# Altium project TX_Board.PrjPcb (part 3 of 5)
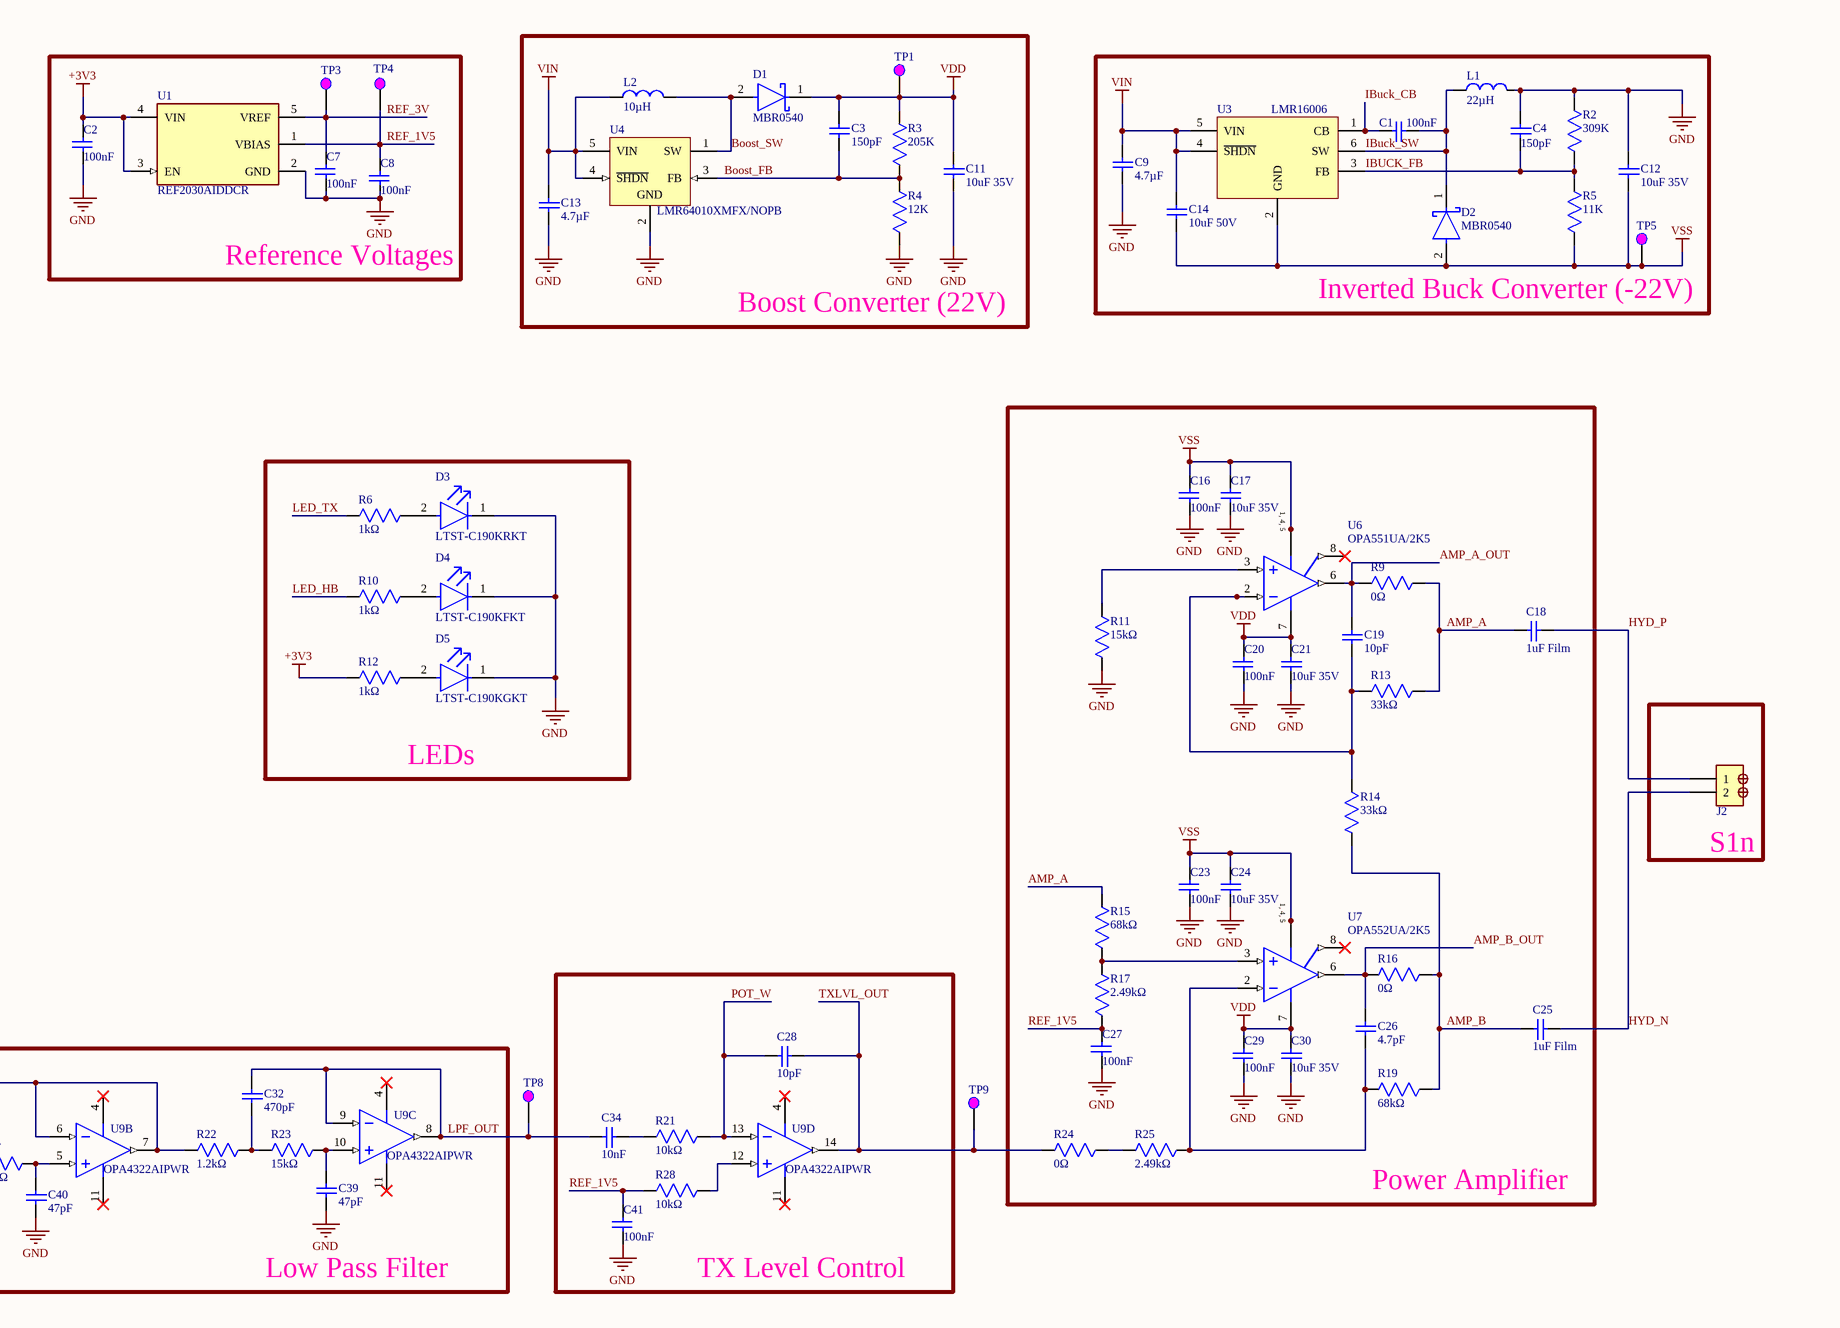
[diagram p3: TX_Board.SchDoc, right]

## Sheet TX_Board.SchDoc (continued)

### Library data of the parts (continued)
C32 C33 = CC0603FRNPO9BN471: 50V 470pF NP0 ±1% 0603 Multilayer Ceramic Capacitors MLCC - SMD/SMT ROHS; Manufacturer: Yageo Group; Dielectric: C0G; Dissipation Factor: 0.1%; Insulation Resistance: 10GΩ; Supplier: Newark; Supplier Part Number: CC0603FRNPO9BN471; Manufacturer Part Number: CC0603FRNPO9BN471; RoHS: Compliant; Category: Ceramic Capacitors; Stock: 7080; Pricing: 1=0.0986, 11=0.0703, 101=0.0582, 501=0.0554, 1001=0.0547 (USD); Value: 470pF; Case/Package: 0603; Case Code (Imperial): 0603; Case Code (Metric): 1608; China RoHS: Compliant; Composition: Ceramic; Depth: 800µm; Dielectric Material: Ceramic; Halogen Free: Halogen Free; Height: 800µm; Lead Free: Lead Free; Length: 1.6mm; Lifecycle Status: Production; Max Operating Temperature: 125°C; Min Operating Temperature: -55°C; Mounting Technology: Surface Mount; Number of Terminals: 2; Packaging: Tape and Reel; Radiation Hardening: No; REACH SVHC: Unaffected; Schedule B: 8532240020, 8532240020|8532240020, 8532240020|8532240020|8532240020, 8532240020|8532240020|8532240020|8532240020; Termination: SMD/SMT; Thickness: 889µm; Tolerance: 1%; Voltage Rating: 50V; Voltage Rating (DC): 50V; Width: 800µm; ComponentLink1URL: https://datasheet.octopart.com:443/CC0603FRNPO9BN471-Yageo-datasheet-182140217.pdf?src-supplier=IHS; ComponentLink1Description: https://datasheet.octopart.com:443/CC0603FRNPO9BN471-Yageo-datasheet-182140217.pdf?src-supplier=IHS; ComponentLink2URL: https://datasheet.octopart.com:443/CC0603FRNPO9BN471-Yageo-datasheet-151948684.pdf?src-supplier=HQonline; ComponentLink2Description: https://datasheet.octopart.com:443/CC0603FRNPO9BN471-Yageo-datasheet-151948684.pdf?src-supplier=HQonline; ComponentLink3URL: https://datasheet.octopart.com:443/CC0603FRNPO9BN471-Yageo-datasheet-182029577.pdf?src-supplier=Newark; ComponentLink3Description: https://datasheet.octopart.com:443/CC0603FRNPO9BN471-Yageo-datasheet-182029577.pdf?src-supplier=Newark; ComponentLink4URL: https://datasheet.octopart.com:443/CC0603FRNPO9BN471-Yageo-datasheet-182029576.pdf?src-supplier=Newark; ComponentLink4Description: https://datasheet.octopart.com:443/CC0603FRNPO9BN471-Yageo-datasheet-182029576.pdf?src-supplier=Newark; ComponentLink5URL: https://datasheet.octopart.com:443/CC0603FRNPO9BN471-Yageo-Group-datasheet-188129580.pdf?src-supplier=LCSC; ComponentLink5Description: https://datasheet.octopart.com:443/CC0603FRNPO9BN471-Yageo-Group-datasheet-188129580.pdf?src-supplier=LCSC; ComponentLink6URL: https://datasheet.octopart.com:443/CC0603FRNPO9BN471-Yageo-datasheet-137875056.pdf?src-supplier=Future+Electronics; ComponentLink6Description: https://datasheet.octopart.com:443/CC0603FRNPO9BN471-Yageo-datasheet-137875056.pdf?src-supplier=Future+Electronics; ComponentLink7URL: https://datasheet.octopart.com:443/CC0603FRNPO9BN471-Yageo-datasheet-136957424.pdf?src-supplier=Future+Electronics; ComponentLink7Description: https://datasheet.octopart.com:443/CC0603FRNPO9BN471-Yageo-datasheet-136957424.pdf?src-supplier=Future+Electronics; ComponentLink8URL: https://datasheet.octopart.com:443/CC0603FRNPO9BN471-Yageo-datasheet-137700082.pdf?src-supplier=Future+Electronics; ComponentLink8Description: https://datasheet.octopart.com:443/CC0603FRNPO9BN471-Yageo-datasheet-137700082.pdf?src-supplier=Future+Electronics; ComponentLink9URL: https://datasheet.octopart.com:443/CC0603FRNPO9BN471-Yageo-datasheet-78855684.pdf?src-supplier=Future+Electronics; ComponentLink9Description: https://datasheet.octopart.com:443/CC0603FRNPO9BN471-Yageo-datasheet-78855684.pdf?src-supplier=Future+Electronics; ComponentLink10URL: https://datasheet.octopart.com:443/CC0603FRNPO9BN471-Yageo-datasheet-16730043.pdf?src-supplier=Future+Electronics; ComponentLink10Description: https://datasheet.octopart.com:443/CC0603FRNPO9BN471-Yageo-datasheet-16730043.pdf?src-supplier=Future+Electronics; ComponentLink11URL: https://datasheet.octopart.com:443/CC0603FRNPO9BN471-Yageo-datasheet-15895757.pdf?src-supplier=Future+Electronics; ComponentLink11Description: https://datasheet.octopart.com:443/CC0603FRNPO9BN471-Yageo-datasheet-15895757.pdf?src-supplier=Future+Electronics; ComponentLink12URL: https://datasheet.octopart.com:443/CC0603FRNPO9BN471-Yageo-datasheet-12589826.pdf?src-supplier=Future+Electronics; ComponentLink12Description: https://datasheet.octopart.com:443/CC0603FRNPO9BN471-Yageo-datasheet-12589826.pdf?src-supplier=Future+Electronics; ComponentLink13URL: https://datasheet.octopart.com:443/CC0603FRNPO9BN471-Yageo-datasheet-10406438.pdf?src-supplier=Future+Electronics; ComponentLink13Description: https://datasheet.octopart.com:443/CC0603FRNPO9BN471-Yageo-datasheet-10406438.pdf?src-supplier=Future+Electronics; ComponentLink14URL: http://sigma.octopart.com:80/conflict_mineral_statement/Yageo-company-3.pdf?src-supplier=Compliance+Statements; ComponentLink14Description: http://sigma.octopart.com:80/conflict_mineral_statement/Yageo-company-3.pdf?src-supplier=Compliance+Statements; ComponentLink15URL: http://sigma.octopart.com:80/rohs_statement/Yageo-company-2.pdf?src-supplier=Compliance+Statements; ComponentLink15Description: http://sigma.octopart.com:80/rohs_statement/Yageo-company-2.pdf?src-supplier=Compliance+Statements; JLCPCB Part Number: C519564
C34 = CC0603JRX7R9BB103: Surface Mount Ceramic Multilayer Capacitor 0.01uF 5% X7R 50V 0603 Paper T/R; Manufacturer: Yageo Group; Supplier: Newark; Supplier Part Number: CC0603JRX7R9BB103; Manufacturer Part Number: CC0603JRX7R9BB103; RoHS: Compliant; Category: Ceramic Capacitors; Stock: 32119; Pricing: 10=0.03, 20=0.029, 30=0.028, 50=0.027, 100=0.026, 250=0.023, 500=0.019, 1000=0.017 (USD); Value: 10nF; Case/Package: 0603; Case Code (Imperial): 0603; Case Code (Metric): 1608; China RoHS: Compliant; Composition: Ceramic; Depth: 800µm; Dielectric: X7R; Dielectric Material: Ceramic; Halogen Free: Halogen Free; Height: 800µm; Lead Free: Lead Free; Length: 1.6mm; Lifecycle Status: Production; Max Operating Temperature: 125°C; Min Operating Temperature: -55°C; Mounting Technology: Surface Mount; Pins: 2; Number of Terminals: 2; Radiation Hardening: No; REACH SVHC: Unaffected; Schedule B: 8532240020, 8532240020|8532240020, 8532240020|8532240020|8532240020, 8532240020|8532240020|8532240020|8532240020; Termination: SMD/SMT; Thickness: 889µm; Tolerance: 5%; Voltage Rating: 50V; Voltage Rating (DC): 50V; Width: 800µm; ComponentLink1URL: https://datasheet.octopart.com:443/CC0603JRX7R9BB103-Yageo-datasheet-177165144.pdf?src-supplier=IHS; ComponentLink1Description: https://datasheet.octopart.com:443/CC0603JRX7R9BB103-Yageo-datasheet-177165144.pdf?src-supplier=IHS; ComponentLink2URL: https://datasheet.octopart.com/CC0603JRX7R9BB103-Yageo-datasheet-10883670.pdf; ComponentLink2Description: https://datasheet.octopart.com/CC0603JRX7R9BB103-Yageo-datasheet-10883670.pdf; ComponentLink3URL: https://datasheet.octopart.com:443/CC0603JRX7R9BB103-Yageo-datasheet-147453679.pdf?src-supplier=Newark; ComponentLink3Description: https://datasheet.octopart.com:443/CC0603JRX7R9BB103-Yageo-datasheet-147453679.pdf?src-supplier=Newark; ComponentLink4URL: https://datasheet.octopart.com:443/CC0603JRX7R9BB103-Yageo-datasheet-140260305.pdf?src-supplier=Farnell; ComponentLink4Description: https://datasheet.octopart.com:443/CC0603JRX7R9BB103-Yageo-datasheet-140260305.pdf?src-supplier=Farnell; ComponentLink5URL: https://datasheet.octopart.com:443/CC0603JRX7R9BB103-Yageo-datasheet-181968368.pdf?src-supplier=Farnell; ComponentLink5Description: https://datasheet.octopart.com:443/CC0603JRX7R9BB103-Yageo-datasheet-181968368.pdf?src-supplier=Farnell; ComponentLink6URL: https://datasheet.octopart.com:443/CC0603JRX7R9BB103-Yageo-datasheet-62336348.pdf?src-supplier=element14+APAC; ComponentLink6Description: https://datasheet.octopart.com:443/CC0603JRX7R9BB103-Yageo-datasheet-62336348.pdf?src-supplier=element14+APAC; ComponentLink7URL: https://datasheet.octopart.com:443/CC0603JRX7R9BB103-Yageo-datasheet-499490.pdf?src-supplier=element14; ComponentLink7Description: https://datasheet.octopart.com:443/CC0603JRX7R9BB103-Yageo-datasheet-499490.pdf?src-supplier=element14; ComponentLink8URL: https://datasheet.octopart.com:443/CC0603JRX7R9BB103-Yageo-datasheet-8701427.pdf?src-supplier=element14; ComponentLink8Description: https://datasheet.octopart.com:443/CC0603JRX7R9BB103-Yageo-datasheet-8701427.pdf?src-supplier=element14; ComponentLink9URL: https://datasheet.octopart.com:443/CC0603JRX7R9BB103-Yageo-datasheet-5301394.pdf?src-supplier=element14; ComponentLink9Description: https://datasheet.octopart.com:443/CC0603JRX7R9BB103-Yageo-datasheet-5301394.pdf?src-supplier=element14; ComponentLink10URL: https://datasheet.octopart.com:443/CC0603JRX7R9BB103-Yageo-datasheet-166511530.pdf?src-supplier=Future+Electronics; ComponentLink10Description: https://datasheet.octopart.com:443/CC0603JRX7R9BB103-Yageo-datasheet-166511530.pdf?src-supplier=Future+Electronics; ComponentLink11URL: https://datasheet.octopart.com:443/CC0603JRX7R9BB103-Yageo-datasheet-137700082.pdf?src-supplier=Future+Electronics; ComponentLink11Description: https://datasheet.octopart.com:443/CC0603JRX7R9BB103-Yageo-datasheet-137700082.pdf?src-supplier=Future+Electronics; ComponentLink12URL: https://datasheet.octopart.com:443/CC0603JRX7R9BB103-Yageo-datasheet-137700084.pdf?src-supplier=Future+Electronics; ComponentLink12Description: https://datasheet.octopart.com:443/CC0603JRX7R9BB103-Yageo-datasheet-137700084.pdf?src-supplier=Future+Electronics; ComponentLink13URL: https://datasheet.octopart.com:443/CC0603JRX7R9BB103-Yageo-datasheet-27626582.pdf?src-supplier=Future+Electronics; ComponentLink13Description: https://datasheet.octopart.com:443/CC0603JRX7R9BB103-Yageo-datasheet-27626582.pdf?src-supplier=Future+Electronics; ComponentLink14URL: https://datasheet.octopart.com:443/CC0603JRX7R9BB103-Yageo-datasheet-15895757.pdf?src-supplier=Future+Electronics; ComponentLink14Description: https://datasheet.octopart.com:443/CC0603JRX7R9BB103-Yageo-datasheet-15895757.pdf?src-supplier=Future+Electronics; ComponentLink15URL: https://datasheet.octopart.com:443/CC0603JRX7R9BB103-Yageo-datasheet-12526321.pdf?src-supplier=Future+Electronics; ComponentLink15Description: https://datasheet.octopart.com:443/CC0603JRX7R9BB103-Yageo-datasheet-12526321.pdf?src-supplier=Future+Electronics; ComponentLink16URL: https://datasheet.octopart.com:443/CC0603JRX7R9BB103-Yageo-Group-datasheet-165992755.pdf?src-supplier=ODG+(Origin+Data+Global); ComponentLink16Description: https://datasheet.octopart.com:443/CC0603JRX7R9BB103-Yageo-Group-datasheet-165992755.pdf?src-supplier=ODG+(Origin+Data+Global); ComponentLink17URL: https://datasheet.octopart.com:443/CC0603JRX7R9BB103-Yageo-datasheet-151948686.pdf?src-supplier=TME; ComponentLink17Description: https://datasheet.octopart.com:443/CC0603JRX7R9BB103-Yageo-datasheet-151948686.pdf?src-supplier=TME; ComponentLink18URL: http://sigma.octopart.com:80/conflict_mineral_statement/Yageo-company-3.pdf?src-supplier=Compliance+Statements; ComponentLink18Description: http://sigma.octopart.com:80/conflict_mineral_statement/Yageo-company-3.pdf?src-supplier=Compliance+Statements; ComponentLink19URL: http://sigma.octopart.com:80/rohs_statement/Yageo-company-2.pdf?src-supplier=Compliance+Statements; ComponentLink19Description: http://sigma.octopart.com:80/rohs_statement/Yageo-company-2.pdf?src-supplier=Compliance+Statements; JLCPCB Part Number: C115056
C39 C40 C42 = CC0603FRNPO9BN470: Surface Mount Ceramic Multilayer Capacitor 47pF 1% C0G 50V 0603 Paper T/R; Manufacturer: Yageo Group; Temperature Coefficient: 30ppm/°C; Supplier: Newark; Supplier Part Number: CC0603FRNPO9BN470; Manufacturer Part Number: CC0603FRNPO9BN470; RoHS: Compliant; Category: Ceramic Capacitors; Stock: 37203; Pricing: 1=0.164, 25=0.068, 100=0.06, 250=0.053, 500=0.046, 1000=0.042, 2500=0.036, 5000=0.03 (USD); Value: 47pF; Case/Package: 0603; Case Code (Imperial): 0603; Case Code (Metric): 1608; China RoHS: Compliant; Composition: Ceramic; Depth: 800µm; Dielectric: C0G; Dielectric Material: Ceramic; Halogen Free: Halogen Free; Height: 800µm; Lead Free: Lead Free; Length: 1.6mm; Lifecycle Status: Production; Max Operating Temperature: 125°C; Min Operating Temperature: -55°C; Mounting Technology: Surface Mount; Pins: 2; Number of Terminals: 2; Radiation Hardening: No; REACH SVHC: Unaffected; Schedule B: 8532240020, 8532240020|8532240020, 8532240020|8532240020|8532240020, 8532240020|8532240020|8532240020|8532240020; Termination: SMD/SMT; Thickness: 889µm; Tolerance: 1%; Voltage: 50V; Voltage Rating: 50V; Voltage Rating (DC): 50V; Width: 800µm; ComponentLink1URL: https://datasheet.octopart.com:443/CC0603FRNPO9BN470-Yageo-datasheet-182140217.pdf?src-supplier=IHS; ComponentLink1Description: https://datasheet.octopart.com:443/CC0603FRNPO9BN470-Yageo-datasheet-182140217.pdf?src-supplier=IHS; ComponentLink2URL: https://datasheet.octopart.com:443/CC0603FRNPO9BN470-Yageo-datasheet-151948684.pdf?src-supplier=element14+APAC; ComponentLink2Description: https://datasheet.octopart.com:443/CC0603FRNPO9BN470-Yageo-datasheet-151948684.pdf?src-supplier=element14+APAC; ComponentLink3URL: https://datasheet.octopart.com:443/CC0603FRNPO9BN470-Yageo-datasheet-65873193.pdf?src-supplier=element14+APAC; ComponentLink3Description: https://datasheet.octopart.com:443/CC0603FRNPO9BN470-Yageo-datasheet-65873193.pdf?src-supplier=element14+APAC; ComponentLink4URL: https://datasheet.octopart.com:443/CC0603FRNPO9BN470-Yageo-datasheet-182029575.pdf?src-supplier=Farnell; ComponentLink4Description: https://datasheet.octopart.com:443/CC0603FRNPO9BN470-Yageo-datasheet-182029575.pdf?src-supplier=Farnell; ComponentLink5URL: https://datasheet.octopart.com:443/CC0603FRNPO9BN470-Yageo-datasheet-182029574.pdf?src-supplier=Farnell; ComponentLink5Description: https://datasheet.octopart.com:443/CC0603FRNPO9BN470-Yageo-datasheet-182029574.pdf?src-supplier=Farnell; ComponentLink6URL: https://datasheet.octopart.com:443/CC0603FRNPO9BN470-Yageo-datasheet-10406438.pdf?src-supplier=Newark; ComponentLink6Description: https://datasheet.octopart.com:443/CC0603FRNPO9BN470-Yageo-datasheet-10406438.pdf?src-supplier=Newark; ComponentLink7URL: https://datasheet.octopart.com:443/CC0603FRNPO9BN470-Yageo-Group-datasheet-189192896.pdf?src-supplier=TME; ComponentLink7Description: https://datasheet.octopart.com:443/CC0603FRNPO9BN470-Yageo-Group-datasheet-189192896.pdf?src-supplier=TME; ComponentLink8URL: https://datasheet.octopart.com:443/CC0603FRNPO9BN470-Yageo-Group-datasheet-188129580.pdf?src-supplier=LCSC; ComponentLink8Description: https://datasheet.octopart.com:443/CC0603FRNPO9BN470-Yageo-Group-datasheet-188129580.pdf?src-supplier=LCSC; ComponentLink9URL: https://datasheet.octopart.com:443/CC0603FRNPO9BN470-Yageo-datasheet-137875056.pdf?src-supplier=Future+Electronics; ComponentLink9Description: https://datasheet.octopart.com:443/CC0603FRNPO9BN470-Yageo-datasheet-137875056.pdf?src-supplier=Future+Electronics; ComponentLink10URL: https://datasheet.octopart.com:443/CC0603FRNPO9BN470-Yageo-datasheet-136957424.pdf?src-supplier=Future+Electronics; ComponentLink10Description: https://datasheet.octopart.com:443/CC0603FRNPO9BN470-Yageo-datasheet-136957424.pdf?src-supplier=Future+Electronics; ComponentLink11URL: https://datasheet.octopart.com:443/CC0603FRNPO9BN470-Yageo-datasheet-137700082.pdf?src-supplier=Future+Electronics; ComponentLink11Description: https://datasheet.octopart.com:443/CC0603FRNPO9BN470-Yageo-datasheet-137700082.pdf?src-supplier=Future+Electronics; ComponentLink12URL: https://datasheet.octopart.com:443/CC0603FRNPO9BN470-Yageo-datasheet-78855684.pdf?src-supplier=Future+Electronics; ComponentLink12Description: https://datasheet.octopart.com:443/CC0603FRNPO9BN470-Yageo-datasheet-78855684.pdf?src-supplier=Future+Electronics; ComponentLink13URL: https://datasheet.octopart.com:443/CC0603FRNPO9BN470-Yageo-datasheet-16730043.pdf?src-supplier=Future+Electronics; ComponentLink13Description: https://datasheet.octopart.com:443/CC0603FRNPO9BN470-Yageo-datasheet-16730043.pdf?src-supplier=Future+Electronics; ComponentLink14URL: https://datasheet.octopart.com:443/CC0603FRNPO9BN470-Yageo-datasheet-12589826.pdf?src-supplier=Future+Electronics; ComponentLink14Description: https://datasheet.octopart.com:443/CC0603FRNPO9BN470-Yageo-datasheet-12589826.pdf?src-supplier=Future+Electronics; ComponentLink15URL: https://datasheet.octopart.com:443/CC0603FRNPO9BN470-Yageo-datasheet-8817079.pdf?src-supplier=Future+Electronics; ComponentLink15Description: https://datasheet.octopart.com:443/CC0603FRNPO9BN470-Yageo-datasheet-8817079.pdf?src-supplier=Future+Electronics; ComponentLink16URL: https://datasheet.octopart.com:443/CC0603FRNPO9BN470-Yageo-datasheet-8324240.pdf?src-supplier=Future+Electronics; ComponentLink16Description: https://datasheet.octopart.com:443/CC0603FRNPO9BN470-Yageo-datasheet-8324240.pdf?src-supplier=Future+Electronics; ComponentLink17URL: https://datasheet.octopart.com:443/CC0603FRNPO9BN470-Yageo-datasheet-504625.pdf?src-supplier=Future+Electronics; ComponentLink17Description: https://datasheet.octopart.com:443/CC0603FRNPO9BN470-Yageo-datasheet-504625.pdf?src-supplier=Future+Electronics; ComponentLink18URL: https://datasheet.octopart.com:443/CC0603FRNPO9BN470-Yageo-datasheet-5321569.pdf?src-supplier=Future+Electronics; ComponentLink18Description: https://datasheet.octopart.com:443/CC0603FRNPO9BN470-Yageo-datasheet-5321569.pdf?src-supplier=Future+Electronics; ComponentLink19URL: http://sigma.octopart.com:80/conflict_mineral_statement/Yageo-company-3.pdf?src-supplier=Compliance+Statements; ComponentLink19Description: http://sigma.octopart.com:80/conflict_mineral_statement/Yageo-company-3.pdf?src-supplier=Compliance+Statements; ComponentLink20URL: http://sigma.octopart.com:80/rohs_statement/Yageo-company-2.pdf?src-supplier=Compliance+Statements; ComponentLink20Description: http://sigma.octopart.com:80/rohs_statement/Yageo-company-2.pdf?src-supplier=Compliance+Statements; JLCPCB Part Number: C519486
D1 D2 = CMP-2000-05114-2: DIODE SCHOTTKY 40V 500MA SOD123; Max Surge Current: 5.5A; Max Reverse Leakage Current: 20uA; Forward Voltage: 620mV; Element Configuration: Single; Polarity: Standard; Power Dissipation: 400mW; Current Rating: 500A; Max Operating Temperature: 125°C; REACH SVHC: No SVHC; Voltage Rating (DC): 40V; Mount: Surface Mount; Max Reverse Voltage (DC): 40V; Max Forward Surge Current (Ifsm): 5.5A; Height: 1.03mm; Package Quantity: 3000; Forward Current: 500mA; Average Rectified Current: 500mA; Weight: 0.03g; Output Current: 500mA; Contact Plating: Tin; Packaging: Tape and Reel; Width: 1.6mm; Radiation Hardening: No; Peak Non-Repetitive Surge Current: 5.5A; Max Repetitive Reverse Voltage (Vrrm): 40V; Length: 2.7mm; Lead Free: Lead Free; Min Operating Temperature: -65°C; Number of Pins: 2; Peak Reverse Current: 20uA; JLCPCB Part Number: C21353
D3 = CMP-1674-00011-2: LED RED CLEAR CHIP SMD; Reverse Voltage: 5V; Viewing Angle: 130°; Power Rating: 75mW; Test Current: 20mA; Number of Elements: 1; Lens Color: Colorless; Wavelength: 639nm; Dominant Wavelength: 631nm; Lens Style: Diffused; Forward Current: 30mA; Forward Voltage: 2.4V; Luminous Intensity: 54mcd; Color: Red; Case Code (Imperial): 0603; Lens Transparency: Clear; Lead Free: Lead Free; Package Quantity: 1; Packaging: Tape and Reel; Max Operating Temperature: 85°C; Number of Pins: 2; Height: 0.8mm; Case/Package: 0603; Number of LEDs: 1; Width: 0.8mm; Case Code (Metric): 1608; Depth: 0.8mm; Mount: Surface Mount; Radiation Hardening: No; Length: 1.6mm; Illumination Color: Red; Power Dissipation: 75mW; Min Operating Temperature: -55°C; JLCPCB Part Number: C94869
D4 = CMP-1674-00008-9: LED ORANGE CLEAR CHIP SMD; Luminous Intensity: 90mcd; Viewing Angle: 130°; Wavelength: 611nm; Lens Color: Colorless; Test Current: 20mA; Lens Style: Flat; Reverse Voltage: 5V; Power Dissipation: 75mW; Number of Elements: 1; Forward Current: 30mA; Lens Size: 0.8mm; Dominant Wavelength: 605nm; Forward Voltage: 2V; Min Operating Temperature: -55°C; Lens Transparency: Clear; RoHS Compliant: Yes; Case Code (Metric): 1608; Color: Orange; Width: 0.8mm; Number of Pins: 2; Depth: 1.6mm; Case/Package: 0603; Radiation Hardening: No; Case Code (Imperial): 0603; Max Operating Temperature: 85°C; Number of LEDs: 1; Height: 0.9mm; Mount: Surface Mount; Packaging: Tape and Reel; Length: 3.2mm; Package Quantity: 3000; Power Rating: 75mW; Lead Free: Lead Free; Illumination Color: Orange; Series: -; JLCPCB Part Number: C157740
D5 = CMP-2000-05197-2: LED GREEN CLEAR CHIP SMD; Test Current: 20mA; Power Rating: 75mW; Forward Voltage: 2V; Wavelength: 574nm; Number of LEDs: 1; Reverse Voltage: 5V; Dominant Wavelength: 571nm; Lens Style: Diffused; Luminous Intensity: 35mcd; Forward Current: 30mA; Viewing Angle: 130°; Lens Color: Colorless; Width: 0.8mm; Case Code (Imperial): 0603; Case Code (Metric): 1608; Number of Pins: 2; Radiation Hardening: No; Package Quantity: 1; Lead Free: Lead Free; Lens Transparency: Clear; Depth: 0.8mm; Power Dissipation: 75mW; Mount: Surface Mount; Max Operating Temperature: 85°C; Case/Package: 0603; Height: 0.8mm; Illumination Color: Green; Color: Green; Length: 1.6mm; Packaging: Tape and Reel; Number of Elements: 1; Min Operating Temperature: -55°C; JLCPCB Part Number: C125094
D6 = SS34: -55℃~+125℃ 3A 40V 500uA@40V 550mV@3A Independent SMA(DO-214AC) Schottky Diodes ROHS; Manufacturer: MDD; Manufacturer Part Number: SS34; Category: Schottky Diodes; JLCPCB Part Number: C8678
D7 = SMAJ15A: SMAJ Series 24.4 V 400 W Surface Mount Uni-Directional TVS Diode - DO-214AC; Manufacturer: Littelfuse; Breakdown Voltage: 17.6V; Clamping Voltage: 24.4V; Direction: Unidirectional; Element Configuration: Single; Forward Voltage: 3.5V; Leakage Current: 1µA; Max Breakdown Voltage: 18.5V; Max Junction Temperature (Tj): 150°C; Max Power Dissipation: 3.3W; Max Surge Current: 16.4A; Min Breakdown Voltage: 16.7V; Number of Channels: 1; Operating Supply Voltage: 15V; Peak Pulse Power: 400W; Power Line Protection: No; Test Current: 1mA; Supplier: Future Electronics; Supplier Part Number: SMAJ15A; Manufacturer Part Number: SMAJ15A; RoHS: Compliant; Category: TVS Diodes; Stock: 635000; Pricing: 5000=0.0662, 10000=0.0652, 15000=0.0646, 25000=0.0638, 50000=0.0622 (USD); Composition: Zener; Country of Origin: Mainland China; Export Control Classification Number (ECCN) Code: EAR99; Height: 2.29mm; Harmonized Tariff Schedule (HTS) Code: 8541.10.00.50; Introduction Date: 2003-11-20; Lead Free: Lead Free; Length: 4.5mm; Lifecycle Status: Production; Max Operating Temperature: 150°C; Max Reverse Leakage Current: 1µA; Min Operating Temperature: -65°C; Mounting Technology: Surface Mount; Number of Elements: 1; Pins: 2; Number of Terminals: 2; Number of Unidirectional Channels: 1; Packaging: Tape & Reel; Peak Pulse Current: 16.4A; Peak Reverse Current: 1µA; Polarity: Unidirectional; Power Dissipation: 400W; Power Rating: 400W; Radiation Hardening: No; REACH SVHC: Affected; Reverse Breakdown Voltage: 16.7V; Reverse Standoff Voltage: 15V; Reverse Voltage: 15V; Schedule B: 8541100080, 8541100080|8541100080|8541100080|8541100080|8541100080; Termination: SMD/SMT; Voltage Rating (DC): 15V; Width: 2.79mm; ComponentLink1URL: https://datasheet.octopart.com:443/SMAJ15A-Littelfuse-datasheet-150463581.pdf?src-supplier=Farnell; ComponentLink1Description: https://datasheet.octopart.com:443/SMAJ15A-Littelfuse-datasheet-150463581.pdf?src-supplier=Farnell; ComponentLink2URL: https://datasheet.octopart.com:443/SMAJ15A-Littelfuse-datasheet-63710798.pdf?src-supplier=Farnell; ComponentLink2Description: https://datasheet.octopart.com:443/SMAJ15A-Littelfuse-datasheet-63710798.pdf?src-supplier=Farnell; ComponentLink3URL: https://datasheet.octopart.com:443/SMAJ15A-Littelfuse-datasheet-11547152.pdf?src-supplier=element14+APAC; ComponentLink3Description: https://datasheet.octopart.com:443/SMAJ15A-Littelfuse-datasheet-11547152.pdf?src-supplier=element14+APAC; ComponentLink4URL: https://datasheet.octopart.com:443/SMAJ15A-Littelfuse-datasheet-5393952.pdf?src-supplier=element14+APAC; ComponentLink4Description: https://datasheet.octopart.com:443/SMAJ15A-Littelfuse-datasheet-5393952.pdf?src-supplier=element14+APAC; ComponentLink5URL: https://datasheet.octopart.com:443/SMAJ15A-Littelfuse-datasheet-511791.pdf?src-supplier=element14+APAC; ComponentLink5Description: https://datasheet.octopart.com:443/SMAJ15A-Littelfuse-datasheet-511791.pdf?src-supplier=element14+APAC; ComponentLink6URL: https://datasheet.octopart.com:443/SMAJ15A-Littelfuse-datasheet-1053.pdf?src-supplier=DigiKey; ComponentLink6Description: https://datasheet.octopart.com:443/SMAJ15A-Littelfuse-datasheet-1053.pdf?src-supplier=DigiKey; ComponentLink7URL: https://datasheet.octopart.com:443/SMAJ15A-Littelfuse-datasheet-164649624.pdf?src-supplier=JRH+Electronics; ComponentLink7Description: https://datasheet.octopart.com:443/SMAJ15A-Littelfuse-datasheet-164649624.pdf?src-supplier=JRH+Electronics; ComponentLink8URL: https://datasheet.octopart.com:443/SMAJ15A-Littelfuse-datasheet-38878911.pdf?src-supplier=RS+(Formerly+Allied+Electronics); ComponentLink8Description: https://datasheet.octopart.com:443/SMAJ15A-Littelfuse-datasheet-38878911.pdf?src-supplier=RS+(Formerly+Allied+Electronics); ComponentLink9URL: https://datasheet.octopart.com:443/SMAJ15A-Littelfuse-datasheet-17901671.pdf?src-supplier=Future+Electronics; ComponentLink9Description: https://datasheet.octopart.com:443/SMAJ15A-Littelfuse-datasheet-17901671.pdf?src-supplier=Future+Electronics; JLCPCB Part Number: C148216
J1 J2 = DB301V-3.5-2P-GN-S: -40℃~+105℃ 0.5~1 1 18~24 1x2P 2 2P 3.5mm 300V 7A 8.5mm Green M2 Through Hole Plugin,P=3.5mm Screw Terminal Blocks ROHS; JLCPCB Part Number: C695629
L1 = SWPA5040S220MT: General Purpose Inductor, 22uH, 20%, 1 Element, Ferrite-Core, SMD, 2020; Manufacturer: Sunlord; DC Resistance (DCR): 168mΩ; Max Current Rating: 1.5A; Number of Circuits: 1; Self Resonant Frequency: 11MHz; Shielding: Shielded; Test Frequency: 100kHz; Supplier: DigiKey; Supplier Part Number: 3442-SWPA5040S220MTCT-ND; Manufacturer Part Number: SWPA5040S220MT; RoHS: Compliant; Category: Fixed Inductors; Stock: 352; Pricing: 1=0.47, 10=0.384, 100=0.3156 (USD); Case/Package: 2020; Core Material: Ferrite; Height: 4mm; Value: 22µH; Length: 5mm; Lifecycle Status: Production; Max Operating Temperature: 125°C; Min Operating Temperature: -40°C; Number of Terminals: 2; REACH SVHC: Unaffected; Tolerance: 20%; Width: 5mm; ComponentLink1URL: https://datasheet.octopart.com:443/SWPA5040S220MT-Sunlord-datasheet-180747130.pdf?src-supplier=IHS; ComponentLink1Description: https://datasheet.octopart.com:443/SWPA5040S220MT-Sunlord-datasheet-180747130.pdf?src-supplier=IHS; JLCPCB Part Number: C68434
L2 = SWPA5040S100MT: General Purpose Inductor, 10uH, 20%, 1 Element, Ferrite-Core, SMD, 2020; Manufacturer: Sunlord; DC Resistance (DCR): 83mΩ; Max Current Rating: 2.1A; Number of Circuits: 1; Self Resonant Frequency: 18MHz; Shielding: Shielded; Test Frequency: 100kHz; Supplier: DigiKey; Supplier Part Number: 3442-SWPA5040S100MTCT-ND; Manufacturer Part Number: SWPA5040S100MT; RoHS: Compliant; Category: Fixed Inductors; Stock: 768; Pricing: 1=0.47, 10=0.384, 100=0.3156 (USD); Case/Package: 2020; Core Material: Ferrite; Height: 4mm; Value: 10µH; Length: 5mm; Lifecycle Status: Production; Max Operating Temperature: 125°C; Min Operating Temperature: -40°C; Number of Terminals: 2; REACH SVHC: Unaffected; Tolerance: 20%; Width: 5mm; ComponentLink1URL: https://datasheet.octopart.com:443/SWPA5040S100MT-Sunlord-datasheet-180747130.pdf?src-supplier=IHS; ComponentLink1Description: https://datasheet.octopart.com:443/SWPA5040S100MT-Sunlord-datasheet-180747130.pdf?src-supplier=IHS; JLCPCB Part Number: C84608
MD1 = CMP-157412-000001-1: TEENSY 4.1 (HEADERS)
P1 = CMP-1712-00002-7: THT Vertical Pin Header WR-PHD, Pitch 2.54 mm, Single Row, 2 pins; Pitch: 2.54mm; Number of Contacts: 2; Connector Type: Male Pin; Gender: Male; Contact Resistance: 20mΩ; Operating Supply Voltage: 250V; Current Rating: 3A; Housing Material: PBT; RoHS: Compliant; Lead Free: Lead Free; Contact Material: Gold; REACH SVHC: No; Min Operating Temperature: -40°C; Termination: Through Hole; Number of Pins: 2; Contact Gender: Male; Packaging: Bulk; Lead Pitch: 2.54mm; Contact Plating: Gold; Orientation: Vertical; Mount: Through Hole; Height: 8.94mm; Color: Black; Number of Positions: 2; Contact Mating Length: 5.9944mm; Max Operating Temperature: 105°C; Voltage Rating: 250V; Number of Rows: 1
R1 R9 R16 R20 R24 = RC0603FR-070RL: Zero Ohm Resistor, Jumper, 0603 [1608 Metric], Thick Film, 100 mW, 1 A, Surface Mount; Manufacturer: Yageo Group; Current Rating: 1A; Max Power Dissipation: 100mW; Temperature Coefficient: 200ppm/°C; Tolerance: 1%; Voltage Rating: 75V; Voltage Rating (DC): 50V; Supplier: Avnet; Supplier Part Number: RC0603FR-070RL; Manufacturer Part Number: RC0603FR-070RL; RoHS: Compliant; Category: Chip SMD Resistors; Stock: 190618; Pricing: 1=0.101, 25=0.009, 100=0.008, 250=0.007, 500=0.006, 1000=0.005, 2500=0.004 (USD); Case/Package: 0603; Case Code (Imperial): 0603; China RoHS: Non-Compliant; Composition: Thick Film; Contact Plating: Tin; Depth: 800µm; Features: Moisture Resistant; Height: 450µm; Lead Free: Lead Free; Length: 1.6mm; Lifecycle Status: Production; Max Operating Temperature: 155°C; Military Standard: Not; Min Operating Temperature: -55°C; Mounting Technology: Surface Mount; Pins: 2; Number of Terminals: 2; Number of Terminations: 2; Packaging: Tape & Reel; Power Rating: 100mW; Radiation Hardening: No; REACH SVHC: Unaffected; Value: 0Ω; Schedule B: 8533210045, 8533210045|8533210045|8533210045|8533210045|8533210045; Termination: SMD/SMT; Width: 800µm; Working Voltage: 75V; ComponentLink1URL: https://datasheet.octopart.com:443/RC0603FR-070RL-Yageo-datasheet-127823281.pdf?src-supplier=Upverter; ComponentLink1Description: https://datasheet.octopart.com:443/RC0603FR-070RL-Yageo-datasheet-127823281.pdf?src-supplier=Upverter; ComponentLink2URL: https://datasheet.octopart.com:443/RC0603FR-070RL-Yageo-datasheet-30459151.pdf?src-supplier=IHS; ComponentLink2Description: https://datasheet.octopart.com:443/RC0603FR-070RL-Yageo-datasheet-30459151.pdf?src-supplier=IHS; ComponentLink3URL: https://datasheet.octopart.com:443/RC0603FR-070RL-Yageo-datasheet-8328172.pdf?src-supplier=element14+APAC; ComponentLink3Description: https://datasheet.octopart.com:443/RC0603FR-070RL-Yageo-datasheet-8328172.pdf?src-supplier=element14+APAC; ComponentLink4URL: https://datasheet.octopart.com:443/RC0603FR-070RL-Yageo-datasheet-34211833.pdf?src-supplier=Newark; ComponentLink4Description: https://datasheet.octopart.com:443/RC0603FR-070RL-Yageo-datasheet-34211833.pdf?src-supplier=Newark; ComponentLink5URL: https://datasheet.octopart.com:443/RC0603FR-070RL-Yageo-Group-datasheet-176638170.pdf?src-supplier=Future+Electronics; ComponentLink5Description: https://datasheet.octopart.com:443/RC0603FR-070RL-Yageo-Group-datasheet-176638170.pdf?src-supplier=Future+Electronics; ComponentLink6URL: https://datasheet.octopart.com:443/RC0603FR-070RL-Yageo-datasheet-164759695.pdf?src-supplier=Future+Electronics; ComponentLink6Description: https://datasheet.octopart.com:443/RC0603FR-070RL-Yageo-datasheet-164759695.pdf?src-supplier=Future+Electronics; ComponentLink7URL: https://datasheet.octopart.com:443/RC0603FR-070RL-Yageo-datasheet-137700087.pdf?src-supplier=Future+Electronics; ComponentLink7Description: https://datasheet.octopart.com:443/RC0603FR-070RL-Yageo-datasheet-137700087.pdf?src-supplier=Future+Electronics; ComponentLink8URL: https://datasheet.octopart.com:443/RC0603FR-070RL-Yageo-datasheet-15599030.pdf?src-supplier=Future+Electronics; ComponentLink8Description: https://datasheet.octopart.com:443/RC0603FR-070RL-Yageo-datasheet-15599030.pdf?src-supplier=Future+Electronics; ComponentLink9URL: https://datasheet.octopart.com:443/RC0603FR-070RL-Yageo-datasheet-12596169.pdf?src-supplier=Future+Electronics; ComponentLink9Description: https://datasheet.octopart.com:443/RC0603FR-070RL-Yageo-datasheet-12596169.pdf?src-supplier=Future+Electronics; ComponentLink10URL: https://datasheet.octopart.com/RC0603FR-070RL-Yageo-datasheet-73766026.pdf; ComponentLink10Description: https://datasheet.octopart.com/RC0603FR-070RL-Yageo-datasheet-73766026.pdf; ComponentLink11URL: http://sigma.octopart.com:80/conflict_mineral_statement/Yageo-company-3.pdf?src-supplier=Compliance+Statements; ComponentLink11Description: http://sigma.octopart.com:80/conflict_mineral_statement/Yageo-company-3.pdf?src-supplier=Compliance+Statements; ComponentLink12URL: http://sigma.octopart.com:80/rohs_statement/Yageo-company-2.pdf?src-supplier=Compliance+Statements; ComponentLink12Description: http://sigma.octopart.com:80/rohs_statement/Yageo-company-2.pdf?src-supplier=Compliance+Statements; JLCPCB Part Number: C100044
R2 = RC0603FR-07309KL: Res Thick Film 0603 309K Ohm 1% 0.1W(1/10W) ±100ppm/C Pad SMD T/R; Manufacturer: Yageo Group; Max Power Dissipation: 100mW; Value: 309kΩ; Temperature Coefficient: 100ppm/°C; Voltage Rating: 75V; Voltage Rating (DC): 50V; Supplier: Avnet; Supplier Part Number: RC0603FR-07309KL; Manufacturer Part Number: RC0603FR-07309KL; RoHS: Compliant; Category: Chip SMD Resistors; Stock: 4091; Pricing: 1=0.101, 25=0.015, 100=0.011, 250=0.010, 500=0.009, 1000=0.008, 2500=0.006 (USD); Case/Package: 0603; Case Code (Imperial): 0603; China RoHS: Non-Compliant; Composition: Thick Film; Country of Origin: Mainland China, Taiwan; Depth: 800µm; Export Control Classification Number (ECCN) Code: EAR99; Features: Moisture Resistant; Height: 450µm; Harmonized Tariff Schedule (HTS) Code: 8533.21.00.30; Introduction Date: 2004-09-22; Lead Free: Lead Free; Length: 1.6mm; Lifecycle Status: Production; Max Operating Temperature: 155°C; Military Standard: Not; Min Operating Temperature: -55°C; Mounting Technology: Surface Mount; Number of Terminals: 2; Number of Terminations: 2; Power Rating: 100mW; REACH SVHC: Unaffected; Schedule B: 8533210045, 8533210045|8533210045, 8533210045|8533210045|8533210045, 8533210045|8533210045|8533210045|8533210045; Termination: SMD/SMT; Tolerance: 1%; Width: 800µm; Working Voltage: 75V; ComponentLink1URL: https://datasheet.octopart.com:443/RC0603FR-07309KL-Yageo-datasheet-175887523.pdf?src-supplier=Newark; ComponentLink1Description: https://datasheet.octopart.com:443/RC0603FR-07309KL-Yageo-datasheet-175887523.pdf?src-supplier=Newark; ComponentLink2URL: https://datasheet.octopart.com:443/RC0603FR-07309KL-Yageo-datasheet-103092701.pdf?src-supplier=Upverter; ComponentLink2Description: https://datasheet.octopart.com:443/RC0603FR-07309KL-Yageo-datasheet-103092701.pdf?src-supplier=Upverter; ComponentLink3URL: https://datasheet.octopart.com:443/RC0603FR-07309KL-Yageo-Group-datasheet-176638170.pdf?src-supplier=Future+Electronics; ComponentLink3Description: https://datasheet.octopart.com:443/RC0603FR-07309KL-Yageo-Group-datasheet-176638170.pdf?src-supplier=Future+Electronics; ComponentLink4URL: https://datasheet.octopart.com:443/RC0603FR-07309KL-Yageo-datasheet-164759695.pdf?src-supplier=Future+Electronics; ComponentLink4Description: https://datasheet.octopart.com:443/RC0603FR-07309KL-Yageo-datasheet-164759695.pdf?src-supplier=Future+Electronics; ComponentLink5URL: https://datasheet.octopart.com:443/RC0603FR-07309KL-Yageo-datasheet-137700087.pdf?src-supplier=Future+Electronics; ComponentLink5Description: https://datasheet.octopart.com:443/RC0603FR-07309KL-Yageo-datasheet-137700087.pdf?src-supplier=Future+Electronics; ComponentLink6URL: https://datasheet.octopart.com:443/RC0603FR-07309KL-Yageo-datasheet-127823281.pdf?src-supplier=Future+Electronics; ComponentLink6Description: https://datasheet.octopart.com:443/RC0603FR-07309KL-Yageo-datasheet-127823281.pdf?src-supplier=Future+Electronics; ComponentLink7URL: https://datasheet.octopart.com:443/RC0603FR-07309KL-Yageo-datasheet-15599030.pdf?src-supplier=Future+Electronics; ComponentLink7Description: https://datasheet.octopart.com:443/RC0603FR-07309KL-Yageo-datasheet-15599030.pdf?src-supplier=Future+Electronics; ComponentLink8URL: https://datasheet.octopart.com:443/RC0603FR-07309KL-Yageo-datasheet-12596169.pdf?src-supplier=Future+Electronics; ComponentLink8Description: https://datasheet.octopart.com:443/RC0603FR-07309KL-Yageo-datasheet-12596169.pdf?src-supplier=Future+Electronics; ComponentLink9URL: https://datasheet.octopart.com:443/RC0603FR-07309KL-Yageo-datasheet-8328172.pdf?src-supplier=Future+Electronics; ComponentLink9Description: https://datasheet.octopart.com:443/RC0603FR-07309KL-Yageo-datasheet-8328172.pdf?src-supplier=Future+Electronics; ComponentLink10URL: https://datasheet.octopart.com/RC0603FR-07309KL-Yageo-datasheet-73766026.pdf; ComponentLink10Description: https://datasheet.octopart.com/RC0603FR-07309KL-Yageo-datasheet-73766026.pdf; ComponentLink11URL: https://datasheet.octopart.com:443/RC0603FR-07309KL-Yageo-datasheet-118562.pdf?src-supplier=DigiKey; ComponentLink11Description: https://datasheet.octopart.com:443/RC0603FR-07309KL-Yageo-datasheet-118562.pdf?src-supplier=DigiKey; ComponentLink12URL: http://sigma.octopart.com:80/conflict_mineral_statement/Yageo-company-3.pdf?src-supplier=Compliance+Statements; ComponentLink12Description: http://sigma.octopart.com:80/conflict_mineral_statement/Yageo-company-3.pdf?src-supplier=Compliance+Statements; ComponentLink13URL: http://sigma.octopart.com:80/rohs_statement/Yageo-company-2.pdf?src-supplier=Compliance+Statements; ComponentLink13Description: http://sigma.octopart.com:80/rohs_statement/Yageo-company-2.pdf?src-supplier=Compliance+Statements; JLCPCB Part Number: C273754
R3 = RT0603BRE07205KL: 100mW Thin Film Resistor ±50ppm/℃ ±0.1% 205kΩ 0603 Chip Resistor - Surface Mount ROHS; Manufacturer: Yageo Group; Temperature Coefficient: 50ppm/°C; Voltage Rating: 75V; Voltage Rating (DC): 50V; Supplier: Avnet; Supplier Part Number: RT0603BRE07205KL; Manufacturer Part Number: RT0603BRE07205KL; RoHS: Compliant; Category: Chip SMD Resistors; Pricing: 5000=0.0472, 10000=0.04696, 20000=0.04673, 40000=0.04649, 80000=0.04626 (USD); Case/Package: 0603; Case Code (Metric): 0603; China RoHS: Non-Compliant; Composition: Thin Film; Contact Plating: Tin; Country of Origin: Mainland China, Taiwan; Export Control Classification Number (ECCN) Code: EAR99; Height: 450µm; Harmonized Tariff Schedule (HTS) Code: 8533.21.00.30; Introduction Date: 2008-07-11; Lead Free: Lead Free; Length: 1.6mm; Lifecycle Status: Production; Max Operating Temperature: 155°C; Max Power Dissipation: 100mW; Min Operating Temperature: -55°C; Mounting Technology: Surface Mount; Number of Terminals: 2; Number of Terminations: 2; Packaging: Tape & Reel (TR); Power Rating: 100mW; Radiation Hardening: No; REACH SVHC: Unaffected; Value: 205kΩ; Tolerance: 0.1%; Width: 800µm; Working Voltage: 75V; ComponentLink1URL: https://datasheet.octopart.com:443/RT0603BRE07205KL-Yageo-datasheet-176402239.pdf?src-supplier=IHS; ComponentLink1Description: https://datasheet.octopart.com:443/RT0603BRE07205KL-Yageo-datasheet-176402239.pdf?src-supplier=IHS; ComponentLink2URL: https://datasheet.octopart.com:443/RT0603BRE07205KL-Yageo-datasheet-96443642.pdf?src-supplier=Upverter; ComponentLink2Description: https://datasheet.octopart.com:443/RT0603BRE07205KL-Yageo-datasheet-96443642.pdf?src-supplier=Upverter; ComponentLink3URL: https://datasheet.octopart.com:443/RT0603BRE07205KL-Yageo-Group-datasheet-188167888.pdf?src-supplier=LCSC; ComponentLink3Description: https://datasheet.octopart.com:443/RT0603BRE07205KL-Yageo-Group-datasheet-188167888.pdf?src-supplier=LCSC; ComponentLink4URL: https://datasheet.octopart.com:443/RT0603BRE07205KL-Yageo-Group-datasheet-141265893.pdf?src-supplier=ODG+(Origin+Data+Global); ComponentLink4Description: https://datasheet.octopart.com:443/RT0603BRE07205KL-Yageo-Group-datasheet-141265893.pdf?src-supplier=ODG+(Origin+Data+Global); ComponentLink5URL: https://datasheet.octopart.com/RT0603BRE07205KL-Yageo-datasheet-86813807.pdf; ComponentLink5Description: https://datasheet.octopart.com/RT0603BRE07205KL-Yageo-datasheet-86813807.pdf; ComponentLink6URL: http://sigma.octopart.com:80/conflict_mineral_statement/Yageo-company-3.pdf?src-supplier=Compliance+Statements; ComponentLink6Description: http://sigma.octopart.com:80/conflict_mineral_statement/Yageo-company-3.pdf?src-supplier=Compliance+Statements; ComponentLink7URL: http://sigma.octopart.com:80/rohs_statement/Yageo-company-2.pdf?src-supplier=Compliance+Statements; ComponentLink7Description: http://sigma.octopart.com:80/rohs_statement/Yageo-company-2.pdf?src-supplier=Compliance+Statements; JLCPCB Part Number: C861745
R4 = RC0603FR-0712KL: 100mW Thick Film Resistors 75V ±100ppm/℃ ±1% 12kΩ 0603 Chip Resistor - Surface Mount ROHS; Manufacturer: Yageo Group; Temperature Coefficient: 100ppm/°C; Voltage Rating: 50V; Supplier: Newark; Supplier Part Number: RC0603FR-0712KL; Manufacturer Part Number: RC0603FR-0712KL; RoHS: Compliant; Category: Chip SMD Resistors; Stock: 210017; Pricing: 1=0.101, 25=0.015, 100=0.011, 250=0.010, 500=0.009, 1000=0.008, 2500=0.006, 5000=0.004 (USD); Case/Package: 0603; Case Code (Imperial): 0603; Case Code (Metric): 1608; China RoHS: Non-Compliant; Composition: Thick Film; Depth: 800µm; Features: Moisture Resistant; Height: 450µm; Lead Free: Lead Free; Length: 1.6mm; Lifecycle Status: Production; Max Operating Temperature: 155°C; Max Power Dissipation: 100mW; Military Standard: Not; Min Operating Temperature: -55°C; Mounting Technology: Surface Mount; Pins: 2; Number of Terminals: 2; Number of Terminations: 2; Packaging: Tape and Reel; Power Rating: 100mW; REACH SVHC: Unaffected; Value: 12kΩ; Schedule B: 8533210045, 8533210045|8533210045|8533210045|8533210045|8533210045; Termination: SMD/SMT; Tolerance: 1%; Voltage Rating (DC): 50V; Width: 800µm; Working Voltage: 75V; ComponentLink1URL: https://datasheet.octopart.com:443/RC0603FR-0712KL-Yageo-datasheet-175887523.pdf?src-supplier=IHS; ComponentLink1Description: https://datasheet.octopart.com:443/RC0603FR-0712KL-Yageo-datasheet-175887523.pdf?src-supplier=IHS; ComponentLink2URL: https://datasheet.octopart.com:443/RC0603FR-0712KL-Yageo-datasheet-8328172.pdf?src-supplier=Newark; ComponentLink2Description: https://datasheet.octopart.com:443/RC0603FR-0712KL-Yageo-datasheet-8328172.pdf?src-supplier=Newark; ComponentLink3URL: https://datasheet.octopart.com:443/RC0603FR-0712KL-Yageo-datasheet-175423674.pdf?src-supplier=Newark; ComponentLink3Description: https://datasheet.octopart.com:443/RC0603FR-0712KL-Yageo-datasheet-175423674.pdf?src-supplier=Newark; ComponentLink4URL: https://datasheet.octopart.com:443/RC0603FR-0712KL-Yageo-datasheet-34211833.pdf?src-supplier=Newark; ComponentLink4Description: https://datasheet.octopart.com:443/RC0603FR-0712KL-Yageo-datasheet-34211833.pdf?src-supplier=Newark; ComponentLink5URL: https://datasheet.octopart.com:443/RC0603FR-0712KL-Yageo-datasheet-62067350.pdf?src-supplier=element14+APAC; ComponentLink5Description: https://datasheet.octopart.com:443/RC0603FR-0712KL-Yageo-datasheet-62067350.pdf?src-supplier=element14+APAC; ComponentLink6URL: https://datasheet.octopart.com:443/RC0603FR-0712KL-Yageo-datasheet-103092701.pdf?src-supplier=Upverter; ComponentLink6Description: https://datasheet.octopart.com:443/RC0603FR-0712KL-Yageo-datasheet-103092701.pdf?src-supplier=Upverter; ComponentLink7URL: https://datasheet.octopart.com:443/RC0603FR-0712KL-Yageo-datasheet-141435368.pdf?src-supplier=Upverter; ComponentLink7Description: https://datasheet.octopart.com:443/RC0603FR-0712KL-Yageo-datasheet-141435368.pdf?src-supplier=Upverter; ComponentLink8URL: https://datasheet.octopart.com:443/RC0603FR-0712KL-Yageo-Group-datasheet-190305687.pdf?src-supplier=Future+Electronics; ComponentLink8Description: https://datasheet.octopart.com:443/RC0603FR-0712KL-Yageo-Group-datasheet-190305687.pdf?src-supplier=Future+Electronics; ComponentLink9URL: https://datasheet.octopart.com:443/RC0603FR-0712KL-Yageo-datasheet-164759695.pdf?src-supplier=Future+Electronics; ComponentLink9Description: https://datasheet.octopart.com:443/RC0603FR-0712KL-Yageo-datasheet-164759695.pdf?src-supplier=Future+Electronics; ComponentLink10URL: https://datasheet.octopart.com:443/RC0603FR-0712KL-Yageo-datasheet-137700087.pdf?src-supplier=Future+Electronics; ComponentLink10Description: https://datasheet.octopart.com:443/RC0603FR-0712KL-Yageo-datasheet-137700087.pdf?src-supplier=Future+Electronics; ComponentLink11URL: https://datasheet.octopart.com:443/RC0603FR0712KL-Yageo-datasheet-27584510.pdf?src-supplier=Future+Electronics; ComponentLink11Description: https://datasheet.octopart.com:443/RC0603FR0712KL-Yageo-datasheet-27584510.pdf?src-supplier=Future+Electronics; ComponentLink12URL: https://datasheet.octopart.com:443/RC0603FR-0712KL-Yageo-datasheet-15599030.pdf?src-supplier=Future+Electronics; ComponentLink12Description: https://datasheet.octopart.com:443/RC0603FR-0712KL-Yageo-datasheet-15599030.pdf?src-supplier=Future+Electronics; ComponentLink13URL: https://datasheet.octopart.com:443/RC0603FR-0712KL-Yageo-datasheet-12596169.pdf?src-supplier=Future+Electronics; ComponentLink13Description: https://datasheet.octopart.com:443/RC0603FR-0712KL-Yageo-datasheet-12596169.pdf?src-supplier=Future+Electronics; ComponentLink14URL: https://datasheet.octopart.com:443/RC0603FR-0712KL-Yageo-datasheet-8324193.pdf?src-supplier=Future+Electronics; ComponentLink14Description: https://datasheet.octopart.com:443/RC0603FR-0712KL-Yageo-datasheet-8324193.pdf?src-supplier=Future+Electronics; ComponentLink15URL: https://datasheet.octopart.com:443/RC0603FR-0712KL-Yageo-Group-datasheet-189192902.pdf?src-supplier=LCSC; ComponentLink15Description: https://datasheet.octopart.com:443/RC0603FR-0712KL-Yageo-Group-datasheet-189192902.pdf?src-supplier=LCSC; ComponentLink16URL: https://datasheet.octopart.com:443/RC0603FR-0712KL-Yageo-Group-datasheet-176638170.pdf?src-supplier=Farnell; ComponentLink16Description: https://datasheet.octopart.com:443/RC0603FR-0712KL-Yageo-Group-datasheet-176638170.pdf?src-supplier=Farnell; ComponentLink17URL: https://datasheet.octopart.com/RC0603FR-0712KL-Yageo-datasheet-73766026.pdf; ComponentLink17Description: https://datasheet.octopart.com/RC0603FR-0712KL-Yageo-datasheet-73766026.pdf; ComponentLink18URL: https://datasheet.octopart.com:443/RC0603FR-0712KL-Yageo-datasheet-30459151.pdf?src-supplier=Seeed+Studio; ComponentLink18Description: https://datasheet.octopart.com:443/RC0603FR-0712KL-Yageo-datasheet-30459151.pdf?src-supplier=Seeed+Studio; ComponentLink19URL: https://datasheet.octopart.com:443/RC0603FR-0712KL-Yageo-datasheet-118562.pdf?src-supplier=DigiKey; ComponentLink19Description: https://datasheet.octopart.com:443/RC0603FR-0712KL-Yageo-datasheet-118562.pdf?src-supplier=DigiKey; ComponentLink20URL: http://sigma.octopart.com:80/conflict_mineral_statement/Yageo-company-3.pdf?src-supplier=Compliance+Statements; ComponentLink20Description: http://sigma.octopart.com:80/conflict_mineral_statement/Yageo-company-3.pdf?src-supplier=Compliance+Statements; ComponentLink21URL: http://sigma.octopart.com:80/rohs_statement/Yageo-company-2.pdf?src-supplier=Compliance+Statements; ComponentLink21Description: http://sigma.octopart.com:80/rohs_statement/Yageo-company-2.pdf?src-supplier=Compliance+Statements; JLCPCB Part Number: C114659